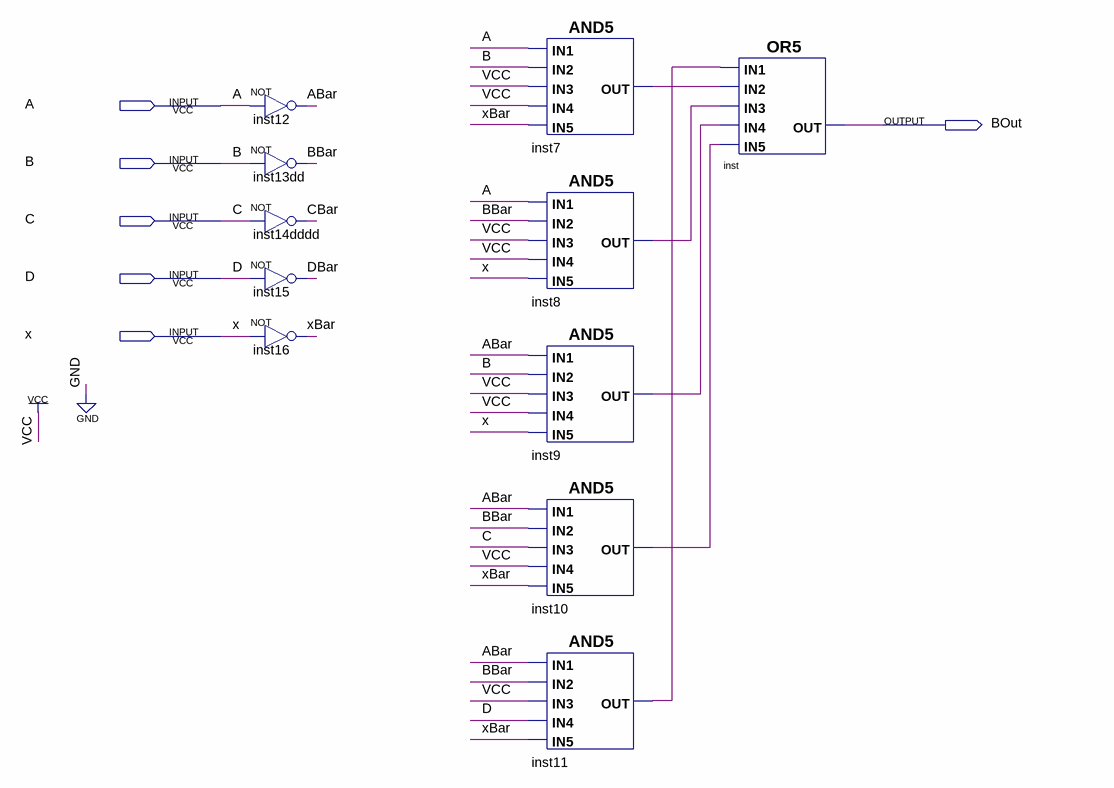
[diagram p0: schematic sheet]
// Quartus schematic BOut.bdf as structural Verilog: 11 symbols, 6 pins
module BOut (
  input  A,
  input  B,
  input  C,
  input  D,
  input  x,
  output BOut
);

  wire ABar, BBar, CBar, DBar, inst7_out, inst8_out, inst9_out, inst10_out, inst11_out, xBar;

  not inst12 (ABar, A);
  not inst13dd (BBar, B);
  not inst14dddd (CBar, C);
  not inst15 (DBar, D);
  not inst16 (xBar, x);
  and inst7 (inst7_out, A, B, 1'b1, 1'b1, xBar);
  and inst8 (inst8_out, A, BBar, 1'b1, 1'b1, x);
  and inst9 (inst9_out, ABar, B, 1'b1, 1'b1, x);
  and inst10 (inst10_out, ABar, BBar, C, 1'b1, xBar);
  and inst11 (inst11_out, ABar, BBar, 1'b1, D, xBar);
  or inst (BOut, inst11_out, inst7_out, inst8_out, inst9_out, inst10_out);
endmodule
